# Altium schematic sheet Display_LCD16x2.SchDoc
size 99 x 81 mm
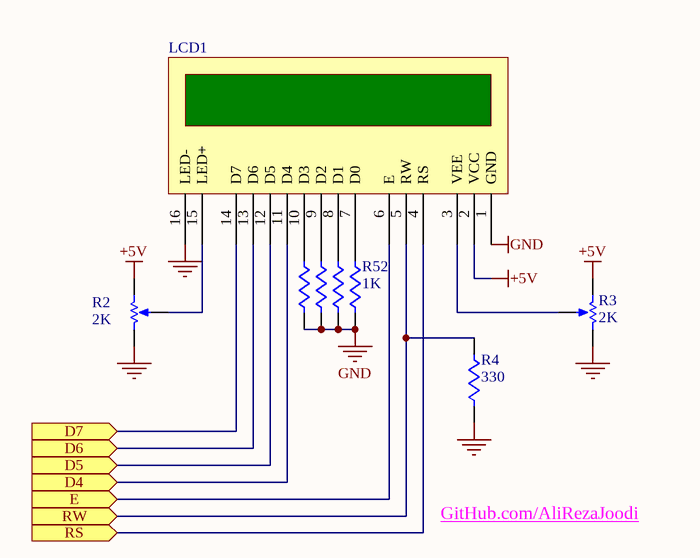
[diagram p0: Display_LCD16x2.SchDoc]

## Parts
LCD1  LCD_16*2  [LCD_2x16]  (value not drawn)
R2  value 2K  [VR8-5/5.6MM]  (hidden comment: RPot1)
R3  value 2K  [VR8-5/5.6MM]  (hidden comment: RPot1)
R4  value 330  [AXIAL-0.4]  (hidden comment: Res1)
R9  Res1  [AXIAL-0.4]  (value not drawn)
R50  Res1  [AXIAL-0.4]  (value not drawn)
R51  Res1  [AXIAL-0.4]  (value not drawn)
R52  value 1K  [AXIAL-0.4]  (hidden comment: Res1)

## Ports
D4 (in), D5 (in), D6 (in), D7 (in), E (in), RS (in), RW (in)

## Nets
+5V: LCD1.2(VCC) R2.1(TOP) R3.2(BOT)
GND: LCD1.1(GND) LCD1.16(LED-) R2.2(BOT) R3.1(TOP) R4.1 R9.1 R50.1 R51.1 R52.1
D4: LCD1.11(D4) ; port D4
D5: LCD1.12(D5) ; port D5
D6: LCD1.13(D6) ; port D6
D7: LCD1.14(D7) ; port D7
E: LCD1.6(E) ; port E
RS: LCD1.4(RS) ; port RS
RW: LCD1.5(RW) R4.2 ; port RW
NetLCD1_3: LCD1.3(VEE) R3.3(TAP)
NetLCD1_7: LCD1.7(D0) R52.2
NetLCD1_8: LCD1.8(D1) R51.2
NetLCD1_9: LCD1.9(D2) R50.2
NetLCD1_10: LCD1.10(D3) R9.2
NetLCD1_15: LCD1.15(LED+) R2.3(TAP)

## Notes on the sheet
- GitHub.com/AliRezaJoodi

## Library data of the parts
R2 R3 = RPot1: Potentiometer; Manufacturer: Generic Components; Class I: Passive; Set Position: 0.5; Published: 8-Jun-2000; Revision: July-2002: Re-released for DXP Platform.; Publisher: Altium Limited; Class II: Potentiometer
R4 R52 = Res1: Resistor; Manufacturer: Generic Components; Class I: Passive; Published: 8-Jun-2000; Revision: July-2002: Re-released for DXP Platform.; Publisher: Altium Limited; Class II: Resistor
R9 R50 R51 = Res1: Resistor; Manufacturer: Generic Components; Class I: Passive; Value: 1K; Published: 8-Jun-2000; Revision: July-2002: Re-released for DXP Platform.; Publisher: Altium Limited; Class II: Resistor